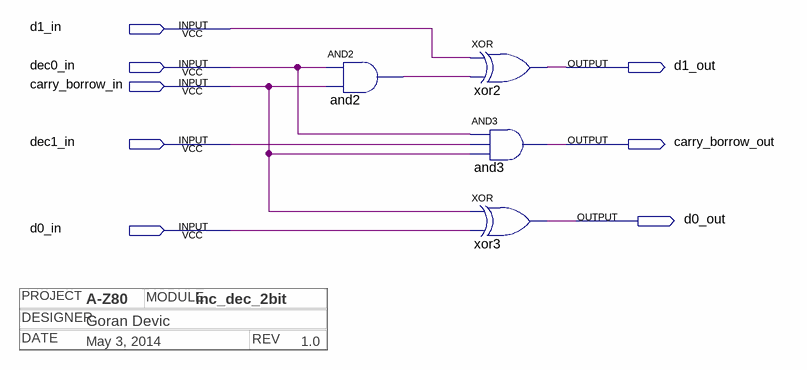
[diagram p0: schematic sheet]
// Quartus schematic inc_dec_2bit.bdf as structural Verilog: 4 symbols, 8 pins
// Title block: DATE: May 3, 2014; DESIGNER: Goran Devic; MODULE: inc_dec_2bit; PROJECT: A-Z80; REV: 1.0
module inc_dec_2bit (
  input  d1_in,
  input  dec0_in,
  input  carry_borrow_in,
  input  dec1_in,
  input  d0_in,
  output d1_out,
  output carry_borrow_out,
  output d0_out
);

  wire and2_out;

  and and2 (and2_out, dec0_in, carry_borrow_in);
  xor xor2 (d1_out, d1_in, and2_out);
  and and3 (carry_borrow_out, dec0_in, dec1_in, carry_borrow_in);
  xor xor3 (d0_out, carry_borrow_in, d0_in);
endmodule
